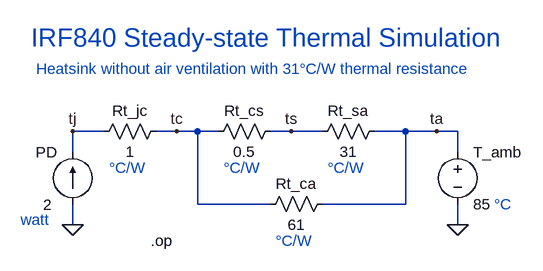
[diagram p0: schematic 02-IRF840_steady_state.asc]
02-IRF840_steady_state.asc, the LTspice schematic file:
Version 4
SHEET 1 880 680
WIRE 80 96 32 96
WIRE 192 96 160 96
WIRE 224 96 192 96
WIRE 256 96 224 96
WIRE 368 96 336 96
WIRE 416 96 368 96
WIRE 544 96 496 96
WIRE 592 96 544 96
WIRE 624 96 592 96
WIRE 32 128 32 96
WIRE 624 128 624 96
WIRE 224 208 224 96
WIRE 336 208 224 208
WIRE 544 208 544 96
WIRE 544 208 416 208
WIRE 32 240 32 208
WIRE 624 240 624 208
FLAG 32 240 0
FLAG 624 240 0
FLAG 32 96 tj
FLAG 192 96 tc
FLAG 592 96 ta
FLAG 368 96 ts
SYMBOL current 32 208 R180
WINDOW 0 24 80 Left 2
WINDOW 3 32 -1 Left 2
WINDOW 123 0 0 Left 0
WINDOW 39 0 0 Left 0
SYMATTR InstName PD
SYMATTR Value 2
SYMBOL res 176 80 R90
WINDOW 0 0 56 VBottom 2
WINDOW 3 32 56 VTop 2
SYMATTR InstName Rt_jc
SYMATTR Value 1
SYMBOL res 352 80 R90
WINDOW 0 0 56 VBottom 2
WINDOW 3 32 56 VTop 2
SYMATTR InstName Rt_cs
SYMATTR Value 0.5
SYMBOL res 512 80 R90
WINDOW 0 0 56 VBottom 2
WINDOW 3 32 56 VTop 2
SYMATTR InstName Rt_sa
SYMATTR Value 31
SYMBOL res 432 192 R90
WINDOW 0 0 56 VBottom 2
WINDOW 3 32 56 VTop 2
SYMATTR InstName Rt_ca
SYMATTR Value 61
SYMBOL voltage 624 112 R0
SYMATTR InstName T_amb
SYMATTR Value 85
TEXT -48 232 Left 2 ;watt
TEXT 88 152 Left 2 ;°C/W
TEXT 264 152 Left 2 ;°C/W
TEXT 424 152 Left 2 ;°C/W
TEXT 344 264 Left 2 ;°C/W
TEXT 680 208 Left 2 ;°C
TEXT 152 264 Left 2 !.op
TEXT -32 -48 Left 4 ;IRF840 Steady-state Thermal Simulation
TEXT -24 0 Left 2 ;Heatsink without air ventilation with 31°C/W thermal resistance

The netlist it stands for:
* 02-IRF840_steady_state.asc
I§PD 0 tj 2
Rt_jc tc tj 1
Rt_cs ts tc 0.5
Rt_sa ta ts 31
Rt_ca ta tc 61
V§T_amb ta 0 85
* watt
* °C/W
* °C/W
* °C/W
* °C/W
* °C
.op
* IRF840 Steady-state Thermal Simulation
* Heatsink without air ventilation with 31°C/W thermal resistance
.backanno
.end

* Results of the author's LTspice run, read from the files saved beside the schematic
* Operating Point:
*   V(tj) = 128.5 V
*   V(tc) = 126.5 V
*   V(ts) = 125.9 V
*   V(ta) = 85 V
*   I(Pd) = 2 A
*   I(Rt_jc) = -2 A
*   I(Rt_cs) = -1.319 A
*   I(Rt_sa) = -1.319 A
*   I(Rt_ca) = -681.1 mA
*   I(T_amb) = 2 A